# Altium schematic sheet interfaceUART&I2C.SchDoc
size A; SheetNumber: 3; SheetTotal: 10
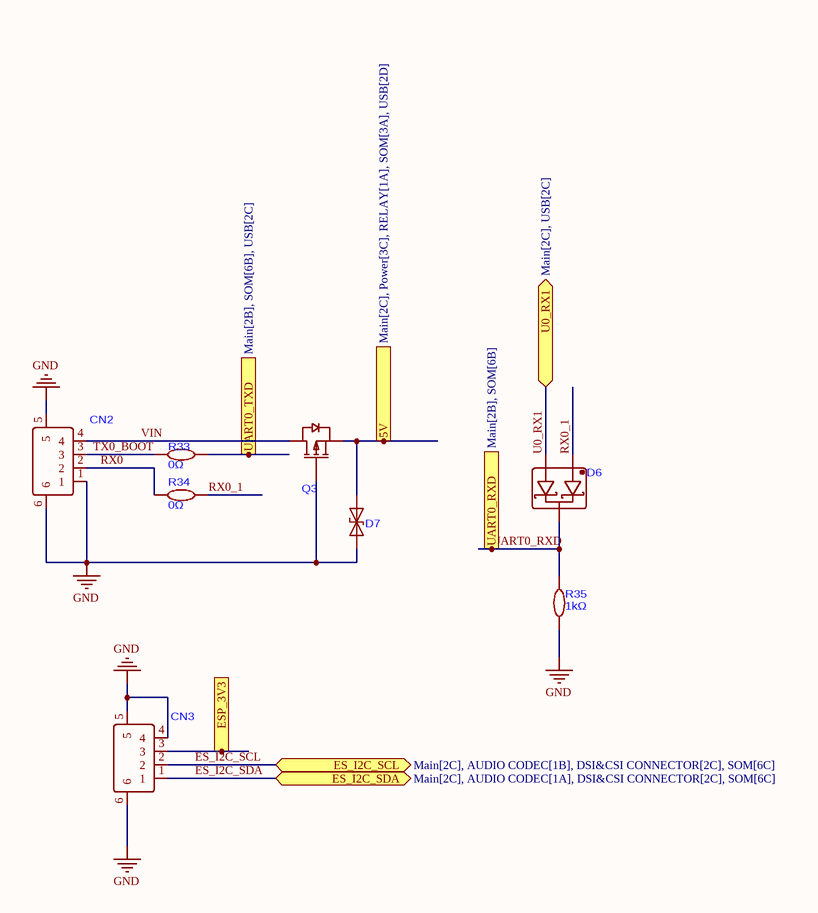
[diagram p0: interfaceUART&I2C.SchDoc]

## Parts
CN2  533980471  [CONN-SMD_4P-P1.25_XUNPU_WAFER-GH1.25-4PWB]  (value not drawn)
CN3  533980471  [CONN-SMD_4P-P1.25_XUNPU_WAFER-GH1.25-4PWB]  (value not drawn)
D6  DIODE ARR SCHOTTKY 30V SOT-23  [SOT-23-3_L2.9-W1.3-P1.90-LS2.4-BR]  (value not drawn)
D7  TVS DIODE 5VWM 9.2VC DO-214AA  [SMB_L4.6-W3.6-LS5.3-BI]  (value not drawn)
Q3  MOSFET P-CH 30V 4.3A SOT-23  [SOT-23-3_L2.9-W1.6-P1.90-LS2.8-BR]  (value not drawn)
R33  0Ω  [R0603]
R34  0Ω  [R0603]
R35  1kΩ  [R0603]

## Ports
5V (in, see Main[2C], Power[3C], RELAY[1A], SOM[3A], USB[2D]), ES_I2C_SCL (bidir, see Main[2C], AUDIO CODEC[1B], DSI&CSI CONNECTOR[2C], SOM[6C]), ES_I2C_SDA (bidir, see Main[2C], AUDIO CODEC[1A], DSI&CSI CONNECTOR[2C], SOM[6C]), ESP_3V3 (in, see Main[2C], DSI&CSI CONNECTOR[3C], ETH-PHY[2A], Power[4C], SOM[6B]), U0_RX1 (bidir, see Main[2C], USB[2C]), UART0_RXD (out, see Main[2B], SOM[6B]), UART0_TXD (in, see Main[2B], SOM[6B], USB[2C])

## Nets
GND: CN2.1 CN2.5 CN2.6 CN3.4 CN3.5 CN3.6 D7.1(K) Q3.1(G) R35.1
5V: D7.2(A) Q3.2(S) ; port 5V
ES_I2C_SCL: CN3.2 ; port ES_I2C_SCL
ES_I2C_SDA: CN3.1 ; port ES_I2C_SDA
ESP_3V3: CN3.3 ; port ESP_3V3
RX0: CN2.2 R34.1
RX0_1: D6.1 R34.2
TX0_BOOT: CN2.3 R33.1
U0_RX1: D6.2 ; port U0_RX1
UART0_RXD: D6.3 R35.2 ; port UART0_RXD
UART0_TXD: R33.2 ; port UART0_TXD
VIN: CN2.4 Q3.3(D)

## Library data of the parts
CN2 CN3 = 533980471: 4P PicoBlade(MX 1.25) 1x4P Tin -40℃~+105℃ White 1.25mm 125V 4 1A 1 Surface Mount,Vertical SMD,P=1.25mm Headers, Male Pins RoHS
D6 = BAT54C_C916424: 600mA 30V 1 Pair Common Cathode 1V@100mA 200mA SOT-23 Single Diodes RoHS
D7 = SMBJ5.0CA_C83323: 65.3A 600W 9.2V 6.4V Bidirectional 5V DO-214AA TVS Diodes RoHS
Q3 = AO3407A: 30V 4.3A 48mΩ@10V 2.5V@250uA 1 P-Channel SOT-23 Single FETs, MOSFETs ROHS
R33 R34 = RC0603JR-070RL: 100mW 0Ω 75V Thick Film Resistor ±5% 0603 Chip Resistor - Surface Mount RoHS
R35 = RMC 0603 1K J N: 100mW 1kΩ 50V ±100ppm/℃ Thick Film Resistor ±5% 0603 Chip Resistor - Surface Mount ROHS